# Altium schematic sheet STM32.SchDoc: STM32 Dev board
size A4; Author: Srđan Milkić; Engineer: Srđan Milkič; SheetNumber: 1; SheetTotal: 1
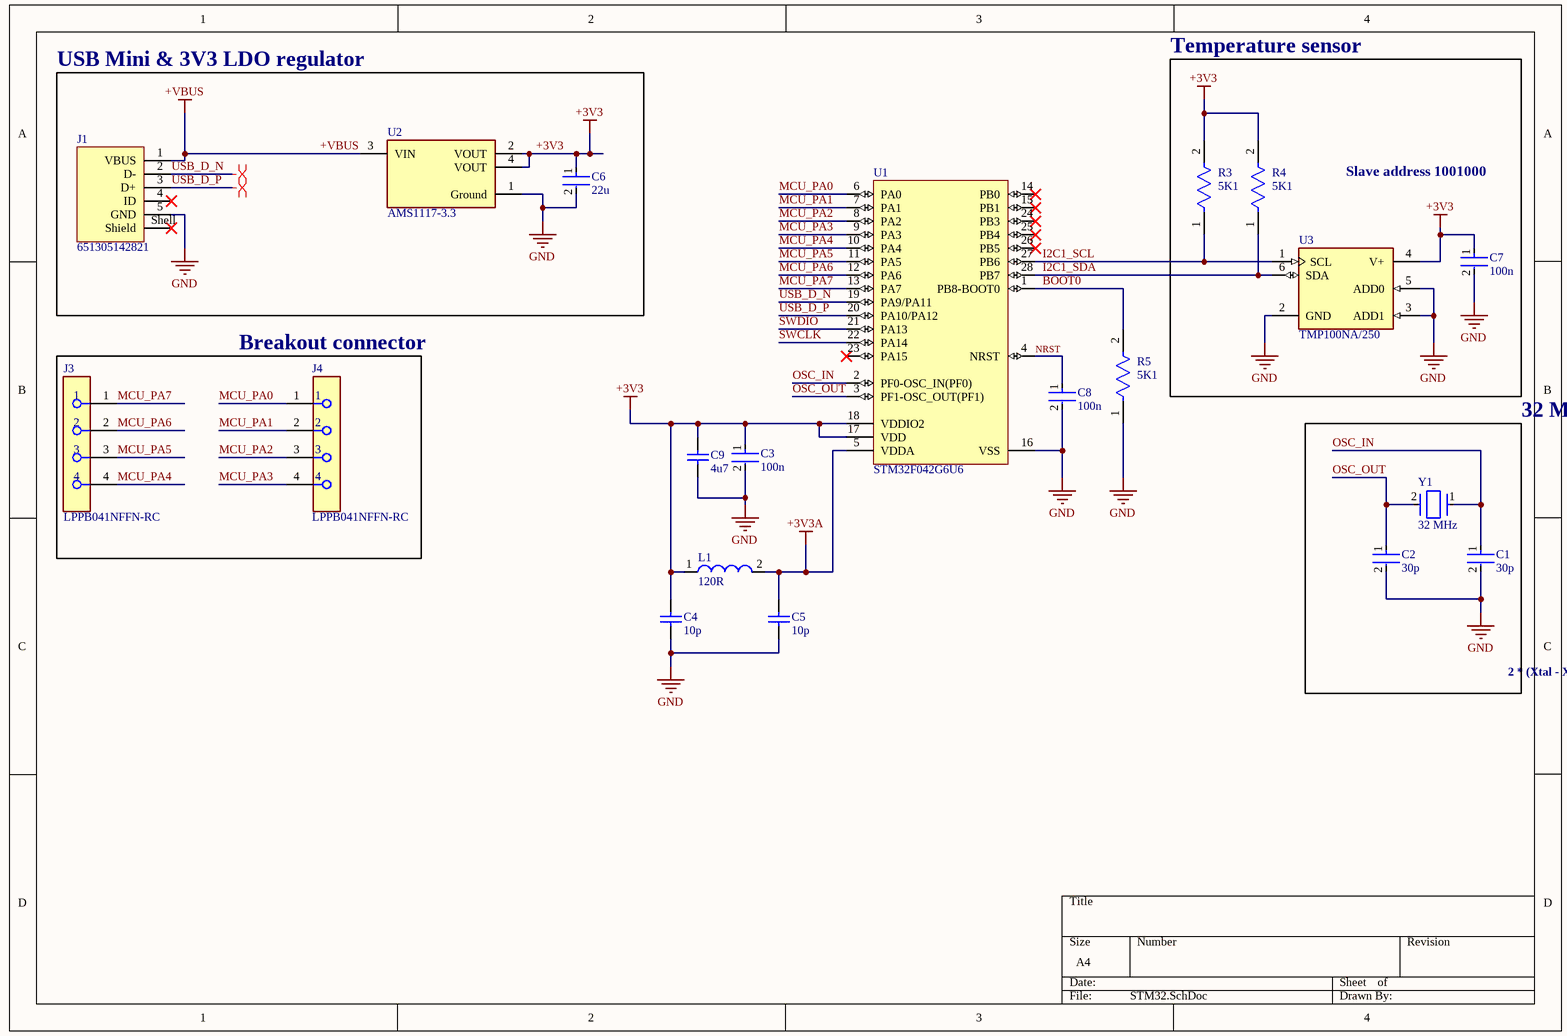
[diagram p0: STM32.SchDoc]

## Parts
C1  30p  [FP-C0603C-CF-MFG]
C2  30p  [FP-C0603C-CF-MFG]
C3  100n  [FP-GRM033-0_03-MFG]
C4  10p  [CAPC1006X50X20ML10T10]
C5  10p  [CAPC1006X50X20ML10T10]
C6  22u  [FP-GRM21B-0_15-MFG]
C7  100n  [FP-GRM033-0_03-MFG]
C8  100n  [FP-GRM033-0_03-MFG]
C9  4u7  [CAPC1608X87X35NL15T15]
J1  651305142821  [651305142821]
J3  LPPB041NFFN-RC  [FP-LPPB041NFFN-RC-MFG]
J4  LPPB041NFFN-RC  [FP-LPPB041NFFN-RC-MFG]
L1  120R  [SMD-1812]
R3  5K1  [FP-AC0402-MFG]
R4  5K1  [FP-AC0402-MFG]
R5  5K1  [FP-AC0402-MFG]
U1  STM32F042G6U6  [STM-UFQFPN28_V]
U2  AMS1117-3.3  [FP-AMS1117-IPC_C]
U3  TMP100NA/250  [FP-DBV0006A-MFG]
Y1  32 MHz  [FP-ABM7-MFG]

## Blocks framed on the sheet
USB Mini & 3V3 LDO regulator: C6 J1 U2
Temperature sensor: C7 R3 R4 U3
Breakout connector: J3 J4
32 MHz crystal: C1 C2 Y1

## Nets
+3V3: C3.1 C4.2 C6.1 C7.1 C9.2 L1.1 R3.2 R4.2 U1.17(VDD) U1.18(VDDIO2) U2.2(VOUT) U2.4(VOUT) U3.4(V+)
+3V3A: C5.2 L1.2 U1.5(VDDA)
+VBUS: J1.1(VBUS) U2.3(VIN)
GND: C1.2 C2.2 C3.2 C4.1 C5.1 C6.2 C7.2 C8.2 C9.1 J1.5(GND) R5.1 U1.16(VSS) U2.1(Ground) U3.2(GND) U3.3(ADD1) U3.5(ADD0)
BOOT0: R5.2 U1.1(PB8-BOOT0)
I2C1_SCL: R3.1 U1.27(PB6) U3.1(SCL)
I2C1_SDA: R4.1 U1.28(PB7) U3.6(SDA)
MCU_PA0: J4.1 U1.6(PA0)
MCU_PA1: J4.2 U1.7(PA1)
MCU_PA2: J4.3 U1.8(PA2)
MCU_PA3: J4.4 U1.9(PA3)
MCU_PA4: J3.4 U1.10(PA4)
MCU_PA5: J3.3 U1.11(PA5)
MCU_PA6: J3.2 U1.12(PA6)
MCU_PA7: J3.1 U1.13(PA7)
NRST: C8.1 U1.4(NRST)
OSC_IN: C1.1 U1.2(PF0-OSC_IN(PF0)) Y1.1
OSC_OUT: C2.1 U1.3(PF1-OSC_OUT(PF1)) Y1.2
SWCLK: U1.22(PA14)
SWDIO: U1.21(PA13)
USB_D_N: J1.2(D-) U1.19(PA9/PA11)
USB_D_P: J1.3(D+) U1.20(PA10/PA12)

Not connected (* = marked no-connect by the designer): J1 4(ID)* Shell(Shield)*; U1 14(PB0)* 15(PB1)* 23(PA15)* 24(PB3)* 25(PB4)* 26(PB5)*

## Layout directives
differential pair: USB_D_N, USB_D_P

## Notes on the sheet
- Slave address 1001000
- 2 * (Xtal - Xcon) = 2 * (18 - 5) ~ 30

## Library data of the parts
C1 C2 = CMP-1035-00914-3: CAP CER 30PF 50V 5% NP0 0603; Manufacturer Part Number: C0603C300J5GACTU; Manufacturer: KEMET; Automotive Grade: Grade 1; Temperature Coefficient: 30ppm/°C; Material: Ceramic; Temperature Characteristic: C0G; Tolerance: 0.05; ComponentLink2URL: https://api.kemet.com/component-edge/download/datasheet/C0603C100J5GACAUTO.pdf; Automotive: Yes; Device Class L2: Capacitors; Device Class L1: Passive Components; Device Class L3: Ceramic Capacitors; RoHS: TRUE; Octopart: https://octopart.com/c0603c300j5gactu-kemet-199455; Lead Free: Yes; Value: 30 pF; Temperature Range High: +125°C; Category: Cap; Temperature: -55°C to +125°C; Package: C0603C-CF; Capacitance: 30 pF; Digikey Description: CAP CER 30PF 50V 5% NP0 0603; Height: 0.87mm; ComponentLink2Description: Datasheet; Temperature Range Low: -55°C; Mouser Description: Multilayer Ceramic Capacitors MLCC - SMD/SMT 50volts 30pF C0G 5%; Voltage Rating: 50 V
C3 C7 C8 = CMP-06035-000062-2: Chip Multilayer Ceramic Capacitors for General Purpose, 0201, 0.10uF, X5R, 15%, 10%, 6.3V; Capacitance: 100nF; Min Operating Temperature: -55°C; Lead Free: Lead Free; Radiation Hardening: No; Dielectric: X5R; Voltage Rating (DC): 6.3V; REACH SVHC: No SVHC; Case/Package: 0201; Voltage Rating: 6.3V; Length: 0.6mm; Max Operating Temperature: 85°C; Width: 0.012inch; Depth: 0.3mm; Material: Ceramic; Case Code (Metric): 0603; Thickness: 0.013inch; Packaging: Tape and Reel; Height: 0.3mm; Weight: 6E-06oz; Package Quantity: 1; Mount: Surface Mount; Voltage: 6.3V; Case Code (Imperial): 0201; Tolerance: 10%; Termination: SMD/SMT
C4 C5 = CMP-2008-04829-1: Manufacturer: AVX Interconnect / Elco; Part Number: 0402YJ100FBSTR
C6 = CMP-2007-03385-2: Chip Multilayer Ceramic Capacitors for General Purpose, 0805, 22uF, X5R, 15%, 20%, 6.3V; Material: Ceramic; Max Operating Temperature: 85°C; Voltage: 6.3V; Min Operating Temperature: -55°C; Case/Package: 0805; Thickness: 0.053inch; Dielectric: X5R; Packaging: Tape and Reel; Depth: 1.25mm; Termination: SMD/SMT; Voltage Rating (DC): 6.3V; Radiation Hardening: No; Tolerance: 20%; Mount: Surface Mount; Lead Free: Lead Free; Package Quantity: 1; REACH SVHC: No SVHC; Voltage Rating: 6.3V; Capacitance: 22uF; Length: 2mm; Case Code (Imperial): 0805; Case Code (Metric): 2012; Width: 0.049inch; Height: 1.25mm
C9 = CMP-2006-03238-1: Part Number: C0603C475K8PACTU; Manufacturer: Kemet
J1 = CMP-1502-03247-2: NexarPartId: 19991175; Operating Supply Voltage: 30V; Current Rating: 1A; Contact Resistance: 20mΩ; Connector Type: USB; Number of Contacts: 5; USB Standard: USB 2.0; Gender: Receptacle; Insulation Resistance: 1GΩ; REACH SVHC: Unknown; Contact Plating: Gold; Min Operating Temperature: -40°C; Features: Shielded; RoHS: Compliant; Contact Material: Copper; Packaging: Tape and Reel; Termination: SMD/SMT; Max Operating Temperature: 105°C; Orientation: Horizontal; Number of Pins: 5; Mount: Horizontal, Surface Mount; Lead Free: Lead Free
J3 J4 = CMP-25680-000035-1: CONN HDR 4POS 0.05 GOLD PCB; Pitch: 0.05inch; Number of Positions: 4; Connector Type: Header; Contact Type: Female Socket; Lead Free: Lead Free; Mount: Through Hole; RoHS Compliant: Yes; Package Quantity: 1; Termination: Solder; Contact Plating: Gold; Number of Rows: 1; Packaging: Bulk
L1 = CMP-0220-00088-1: SMD EMI Suppression Ferrite Bead WE-CBF, Z = 120 Ohm; Impedance: 120 Ohm; DatasheetVersion: Dec-2005; PackageVersion: 2010; ComponentLink2URL: http://www.we-online.de/katalog/media/pdf/7427925.pdf; ComponentLink1URL: http://www.we-online.com; ComponentLink1Description: Manufacturer Link; PackageDescription: Chip Inductor, 2-Leads, Body 4.5 x 3.2 mm; PackageReference: SMD-1812; ComponentLink2Description: Datasheet
R3-R5 = CMP-2002-01829-3: RES 5.1kΩ ±1% 0.063W 0402; Max Power Dissipation: 63mW; Resistance: 5.1kR; Temperature Coefficient: 100ppm/°C; Military Standard: Not; Number of Terminations: 2; Series: AC; Case/Package: 0402; Width: 0.02inch; Power Rating: 63mW; Features: Moisture Resistant; Max Operating Temperature: 155°C; Size Code: 0402; Packaging: Cut Tape; Length: 0.039inch; Lead Free: Lead Free; Mount: Surface Mount; Case Code (Imperial): 0402; Height: 0.015inch; Case Code (Metric): 1005; Depth: 0.5mm; Min Operating Temperature: -55°C; Tolerance: 1%; RoHS Compliant: Yes; Resistor Type: Thick Film
U1 = CMP-0304-00112-2: ARM Cortex-M0 32-bit MCU, 32 KB Flash, 6 KB Internal RAM, 24 I/Os, 28-Pin UFQFPN, -40 to 85 degC, Tray; Manufacturer: STMicroelectronics; FLASH Size (Prog) (kB): 32; I/Os (High Current): 24; Internal RAM Size (kB): 6; Supply Voltage(Vcc) min (V): 2; Operating Frequency(F) (Processor speed) (MHz): 48; Core: ARM Cortex-M0; PartNumber: STM32F042G6U6; Packing: Tray; Package Description: 28-Pin Ultra Thin Fine Pitch Quad Flat No-Lead, 4 x 4 x 0.6 mm Body, 0.5 mm Pitch; ComponentLink2Description: Datasheet; ComponentLink1Description: Manufacturer URL; Package Reference: UFQFPN28; DatasheetVersion: Rev. 5; ComponentLink1URL: http://www.st.com/; ComponentLink2URL: http://www.st.com/st-web-ui/static/active/en/resource/technical/document/datasheet/DM00105814.pdf; Mounting Technology: Surface Mount
U2 = CMP-209535-000001-1: LDO Voltage Regulators 1A, 3.3V; Manufacturer: Advanced Monolithic Systems; Dropout Voltage: 1.1V; Output Type: Fixed; Nominal Supply Current: 5mA; Max Power Dissipation: 1.2W; Max Supply Voltage: 15V; Number Of Outputs: 1; Standoff Height: 0.64mm; Max Junction Temp: +125°C; Height: 1.8mm; Package: AMS1117; Device Class L2: Power Management ICs; ComponentLink2Description: Datasheet; ComponentLink2URL: http://www.advanced-monolithic.com/pdf/ds1117.pdf; Category: IC; RoHS: TRUE; Automotive: No; Device Class L1: Integrated Circuits (ICs); Output Current: 1A; Device Class L3: Voltage Regulators - Linear; Temperature: -40°C to +125°C; Output Voltage: 3.3V; Manufacturer Part Number: AMS1117-3.3; Temperature Range Low: -40°C; Octopart: https://octopart.com/ams1117-3.3-advanced+monolithic+systems-25899300; Lead Free: Yes; Ipc Land Pattern Name: SOT229P700X180-4; Temperature Range High: +125°C
U3 = CMP-04948-000008-1: SENSOR DIGITAL -55C-125C SOT23-6; Manufacturer: Texas Instruments; Sensor Output: I2C,SMBus; Max Junction Temp: +150°C; Max Supply Voltage: 5.5V; Operating Supply Current: 45-150uA; Resolution: 12bits; Interface: I2C,2-Wire,SMBus; Standoff Height: 0mm; Min Supply Voltage: 2.7V; Mouser Description: TEXAS INSTRUMENTS - TMP100NA/250 - IC, TEMPERATURE SENSOR; Height: 1.45mm; Ipc Land Pattern Name: SOT95P280X145-6; ComponentLink2URL: http://www.ti.com/lit/ds/symlink/tmp100.pdf; Ambient Temperature Range Low: -55°C; Temperature Range Low: -55°C; Temperature Range High: +125°C; Octopart: https://octopart.com/tmp100na%2F250-texas+instruments-515369; Package: DBV0006A; Digikey Description: SENSOR DIGITAL -55C-125C SOT23-6; Device Class L2: Temperature and Humidity Sensors; ComponentLink2Description: Datasheet; Device Class L3: unset; Automotive: No; Lead Free: Yes; Device Class L1: Sensors; Manufacturer Part Number: TMP100NA/250; Temperature: -55°C to +125°C; Ambient Temperature Range High: +125°C; Category: IC; RoHS: TRUE
Y1 = CMP-27762-013665-1: Crystal 32MHz ±20ppm 18pF SMD-2 6mm x 3.5mm; ESR (Equivalent Series Resistance): 50R; Frequency Stability: 30ppm; Operating Frequency: 32 MHz; Termination: SMD/SMT; Packaging: Tape and Reel; Min Operating Temperature: -40°C; Lead Free: Lead Free; Series: ABM7; Load Capacitance: 18pF; Tolerance: 20ppm; Depth: 3.5mm; Frequency Tolerance: 20ppm; Number of Pins: 2; Radiation Hardening: No; Width: 3.3mm; Mount: Surface Mount; Height: 0.055inch; Max Operating Temperature: 85°C; Series Resistance: 50R; Package Quantity: 1000; Resistor Type: Ceramic; Length: 6mm; Frequency: 32MHz; Case/Package: CSMD